# Altium schematic sheet S4V_IMU_Sensor_Module_Board_V1.0_Schematic.SchDoc
size A3; SheetNumber: 1; SheetTotal: 1
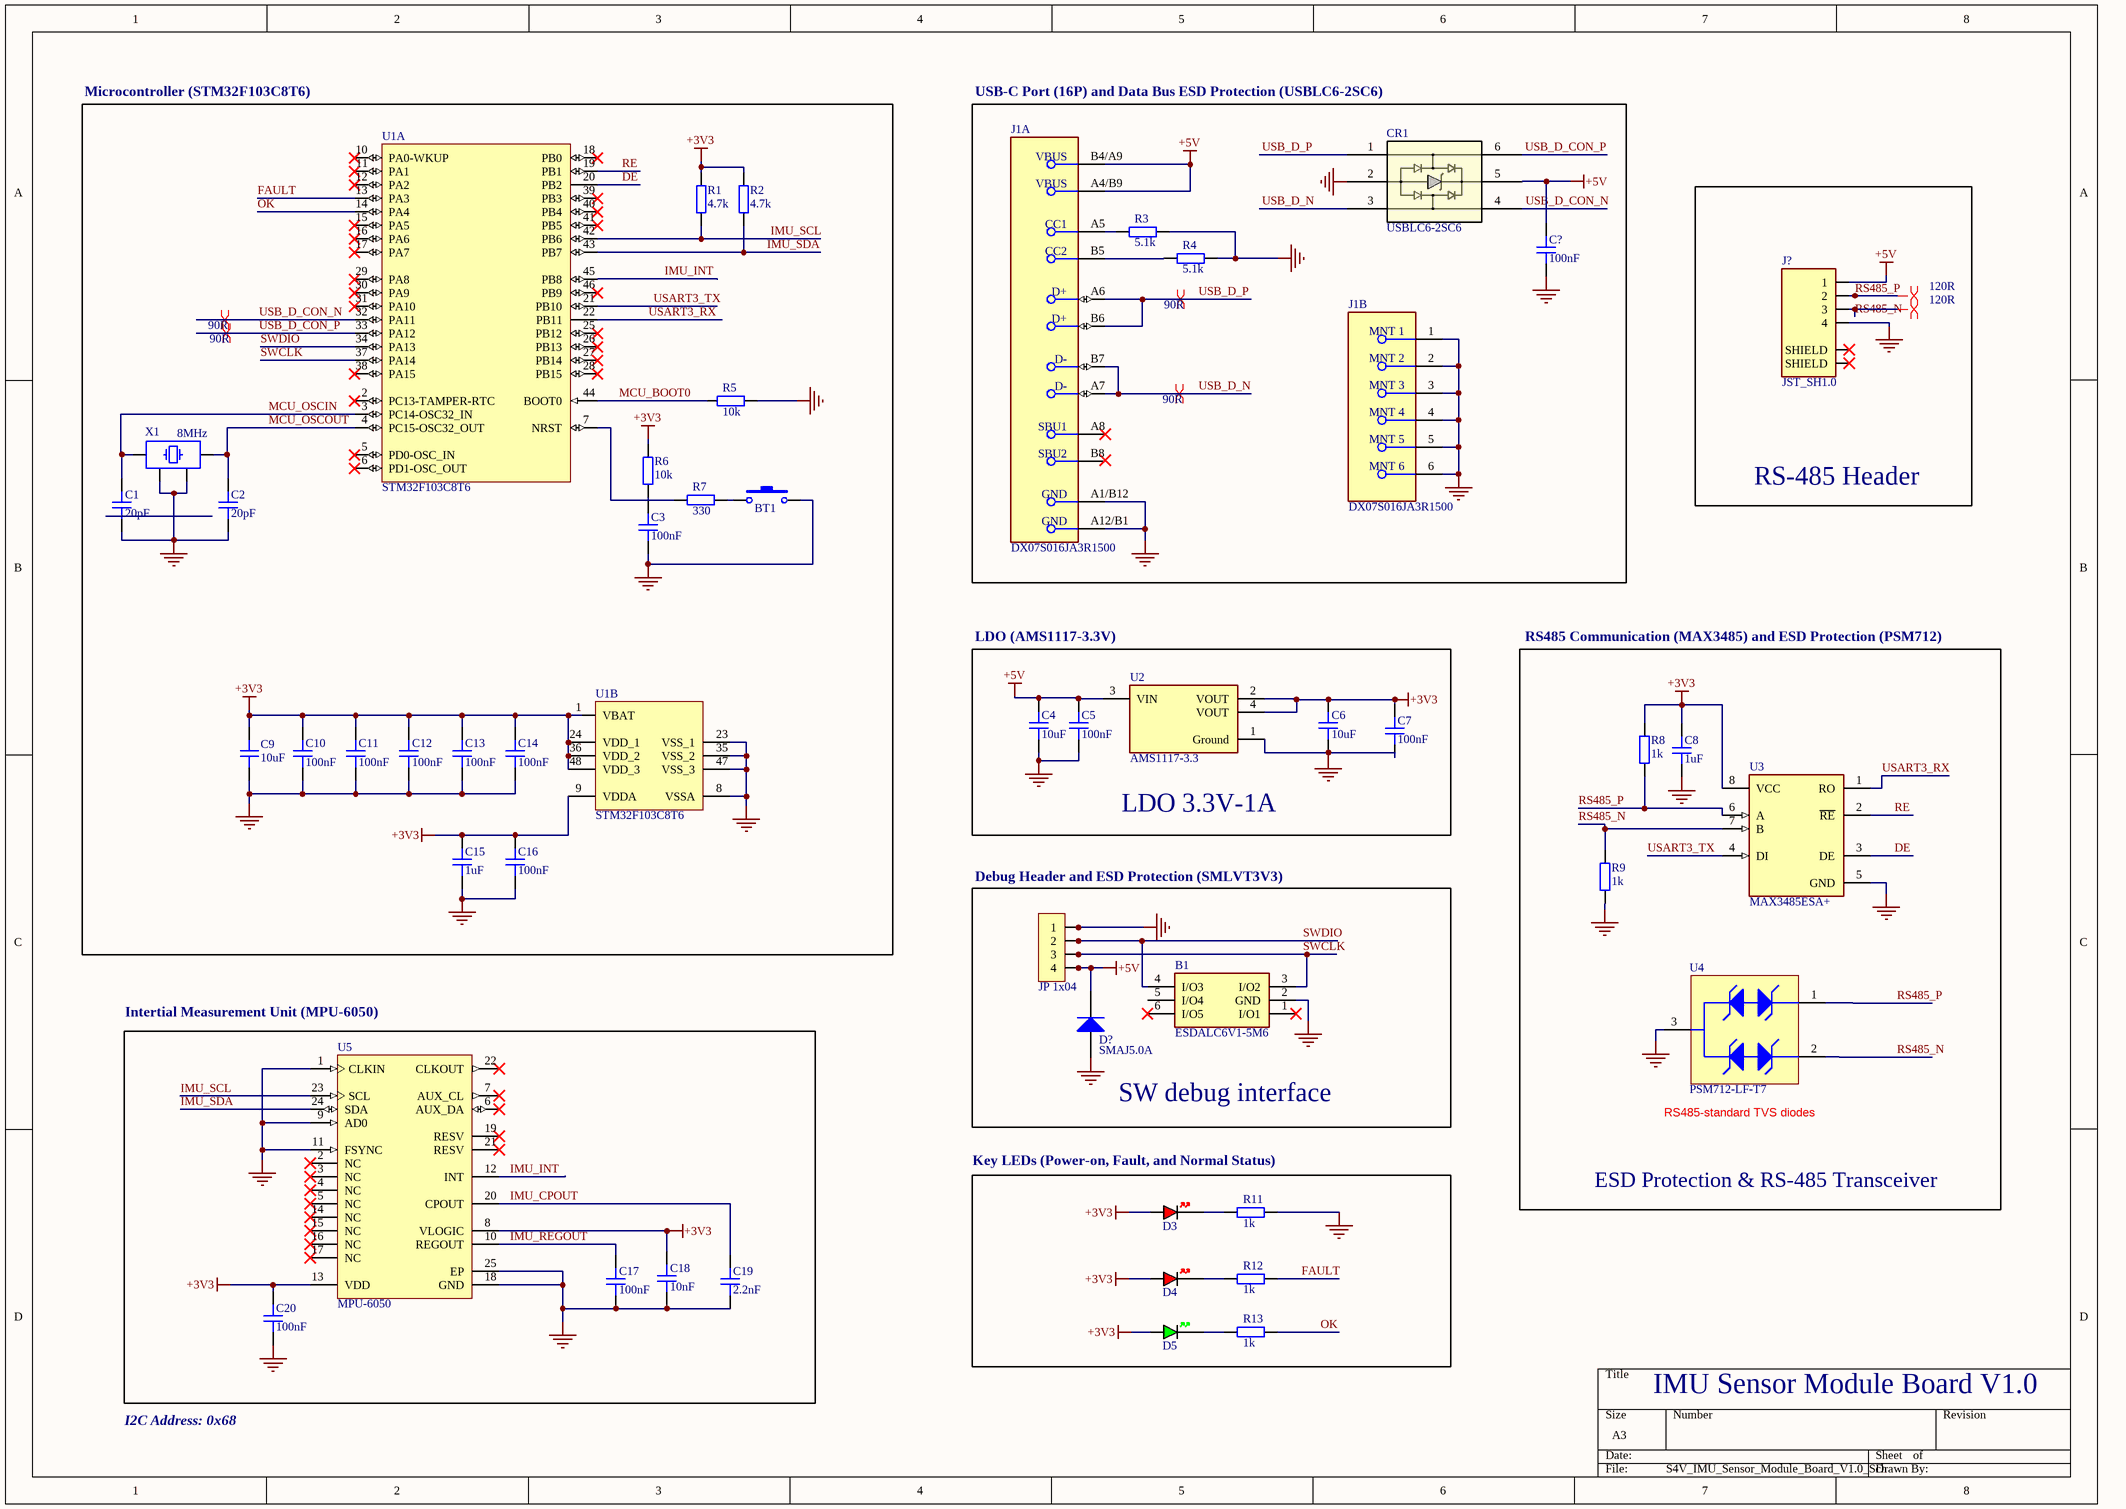
[diagram p0: S4V_IMU_Sensor_Module_Board_V1.0_Schematic.SchDoc]

## Parts
B1  ESDALC6V1-5M6  [ESDALC6V15M6]
BT1  Nut Nhan 2 Chan SMD 3x6x2.5  [Nut Nhan 2 Chan SMD 3x6x2.5]  (value not drawn)
C1  20pF  [CAP_0603]
C2  20pF  [CAP_0603]
C3  100nF  [CAP_0603]
C4  10uF  [CAP_0603]
C5  100nF  [CAP_0603]
C6  10uF  [CAP_0603]
C7  100nF  [CAP_0603]
C8  1uF  [CAP_0603]
C9  10uF  [CAP_0603]
C10  100nF  [CAP_0603]
C11  100nF  [CAP_0603]
C12  100nF  [CAP_0603]
C13  100nF  [CAP_0603]
C14  100nF  [CAP_0603]
C15  1uF  [CAP_0603]
C16  100nF  [CAP_0603]
C17  100nF  [CAP_0603]
C18  10nF  [CAP_0603]
C19  2.2nF  [CAP_0603]
C20  100nF  [CAP_0603]
C?  100nF  [CAP_0603]
CR1  USBLC6-2SC6  [SOT23-6L_STM]
D3  RED  [LED_0603_RED]  (value not drawn)
D4  RED  [LED_0603_RED]  (value not drawn)
D5  GREEN  [LED_0603_GREEN]  (value not drawn)
D?  SMAJ5.0A  [BOUR-SMA-2_V]
J1  DX07S016JA3R1500  [FP-DX07S016JA3R1500-MFG]  (parts A,B of 2)
J?  JST_SH1.0  [JST_SM04B-SRSS-TB(LF)(SN)]
JP1  JP 1x04  [JP 1x4 DT]
R1  4.7k  [RES_0603]
R2  4.7k  [RES_0603]
R3  5.1k  [RES_0603]
R4  5.1k  [RES_0603]
R5  10k  [RES_0603]
R6  10k  [RES_0603]
R7  330  [RES_0603]
R8  1k  [RES_0603]
R9  1k  [RES_0603]
R11  1k  [RES_0603]
R12  1k  [RES_0603]
R13  1k  [RES_0603]
U1  STM32F103C8T6  [STM-LQFP48_L]  (parts A,B of 2)
U2  AMS1117-3.3  [FP-AMS1117-IPC_C]
U3  MAX3485ESA+  [FP-S8-5-MFG]
U4  PSM712-LF-T7  [PRKT-SOT23-3_V]
U5  MPU-6050  [IS-QFN-24_V]
X1  8MHz  [XTAL_3225]

## Blocks framed on the sheet
Microcontroller (STM32F103C8T6): BT1 C1-C3 C9-C16 R1 R2 R5-R7 U1 X1
USB-C Port (16P) and Data Bus ESD Protection (USBLC6-2SC6): C? CR1 J1 R3 R4
RS-485 Header: J?
LDO 3.3V-1A: C4-C7 U2
ESD Protection & RS-485 Transceiver: C8 R8 R9 U3 U4
SW debug interface: B1 D? JP1
Intertial Measurement Unit (MPU-6050): C17-C20 U5
Key LEDs (Power-on, Fault, and Normal Status): D3-D5 R11-R13

## Nets
+3V3: C6.2 C7.2 C8.2 C9.2 C10.2 C11.2 C12.2 C13.2 C14.2 C15.2 C16.2 C18.2 C20.2 D3.A D4.A D5.A R1.2 R2.2 R6.2 R8.1 U1.1(VBAT) U1.9(VDDA) U1.24(VDD_1) U1.36(VDD_2) U1.48(VDD_3) U2.2(VOUT) U2.4(VOUT) U3.8(VCC) U5.8(VLOGIC) U5.13(VDD)
+5V: C4.2 C5.2 C?.2 CR1.5 D?.2(K) J1.A4/B9(VBUS) J1.B4/A9(VBUS) J?.1 JP1.4 U2.3(VIN)
GND: B1.2(GND) BT1.2 C1.1 C2.1 C3.1 C4.1 C5.1 C6.1 C7.1 C8.1 C9.1 C10.1 C11.1 C12.1 C13.1 C14.1 C15.1 C16.1 C17.1 C18.1 C19.1 C20.1 C?.1 CR1.2 D?.1(A) J1.1(MNT_1) J1.2(MNT_2) J1.3(MNT_3) J1.4(MNT_4) J1.5(MNT_5) J1.6(MNT_6) J1.A1/B12(GND) J1.A12/B1(GND) J?.4 JP1.1 R3.2 R4.2 R5.2 R9.1 R11.2 U1.8(VSSA) U1.23(VSS_1) U1.35(VSS_2) U1.47(VSS_3) U2.1(Ground) U3.5(GND) U4.3 U5.1(CLKIN) U5.9(AD0) U5.11(FSYNC) U5.18(GND) U5.25(EP) X1.2 X1.4
DE: U1.20(PB2) U3.3(DE)
FAULT: R12.2 U1.13(PA3)
IMU_CPOUT: C19.2 U5.20(CPOUT)
IMU_INT: U1.45(PB8) U5.12(INT)
IMU_REGOUT: C17.2 U5.10(REGOUT)
IMU_SCL: R1.1 U1.42(PB6) U5.23(SCL)
IMU_SDA: R2.1 U1.43(PB7) U5.24(SDA)
MCU_BOOT0: R5.1 U1.44(BOOT0)
MCU_OSCIN: C1.2 U1.3(PC14-OSC32_IN) X1.1
MCU_OSCOUT: C2.2 U1.4(PC15-OSC32_OUT) X1.3
OK: R13.2 U1.14(PA4)
RE: U1.19(PB1) U3.2(~{RE})
RS485_N: J?.3 R9.2 U3.7(B) U4.2
RS485_P: J?.2 R8.2 U3.6(A) U4.1
SWCLK: B1.3(I/O2) JP1.3 U1.37(PA14)
SWDIO: B1.4(I/O3) JP1.2 U1.34(PA13)
USART3_RX: U1.22(PB11) U3.1(RO)
USART3_TX: U1.21(PB10) U3.4(DI)
USB_D_CON_N: CR1.4 U1.32(PA11)
USB_D_CON_P: CR1.6 U1.33(PA12)
USB_D_N: CR1.3 J1.A7(D-) J1.B7(D-)
USB_D_P: CR1.1 J1.A6(D+) J1.B6(D+)
NetBT1_1: BT1.1 R7.2
NetC3_2: C3.2 R6.1
NetD3_K: D3.K R11.1
NetD4_K: D4.K R12.1
NetD5_K: D5.K R13.1
NetJ1_A5: J1.A5(CC1) R3.1
NetJ1_B5: J1.B5(CC2) R4.1
NetR7_1: R7.1 U1.7(NRST)

Not connected (* = marked no-connect by the designer): B1 1(I/O1)* 5(I/O4) 6(I/O5)*; J1 A8(SBU1)* B8(SBU2); J? S1(SHIELD)* S2(SHIELD)*; U1 2(PC13-TAMPER-RTC)* 5(PD0-OSC_IN)* 6(PD1-OSC_OUT)* 10(PA0-WKUP)* 11(PA1)* 12(PA2)* 15(PA5)* 16(PA6)* 17(PA7)* 18(PB0)* 25(PB12)* 26(PB13)* 27(PB14)* 28(PB15)* 29(PA8)* 30(PA9)* 31(PA10)* 38(PA15)* 39(PB3)* 40(PB4)* 41(PB5)* 46(PB9)*; U5 2(NC)* 3(NC)* 4(NC)* 5(NC)* 6(AUX_DA)* 7(AUX_CL)* 14(NC)* 15(NC)* 16(NC)* 17(NC)* 19(RESV)* 21(RESV)* 22(CLKOUT)*

## Layout directives
differential pair; differential pair class 120R: RS485_N, RS485_P
differential pair; differential pair class 90R: USB_D_CON_N, USB_D_CON_P, USB_D_N, USB_D_P

## Notes on the sheet
- LDO (AMS1117-3.3V)
- RS485 Communication (MAX3485) and ESD Protection (PSM712)
- (near JP1) Debug Header and ESD Protection (SMLVT3V3)
- (near U4) RS485-standard TVS diodes
- IMU Sensor Module Board V1.0
- I2C Address: 0x68

## Library data of the parts
B1 = ESDALC6V1-5M6: STMicroelectronics ESDALC6V1-5M6 Quint Uni-Directional TVS Diode, 30W peak, 6-Pin uQFN; Geometry.Height: 0.65mm; Manufacturer_Name: STMicroelectronics; Manufacturer_Part_Number: ESDALC6V1-5M6; Mouser Part Number: 511-ESDALC6V1-5M6; Mouser Price/Stock: https://www.mouser.co.uk/ProductDetail/STMicroelectronics/ESDALC6V1-5M6?qs=riAxU6JNBCsF7CaldDOuJw%3D%3D; Arrow Part Number: ESDALC6V1-5M6; Arrow Price/Stock: https://www.arrow.com/en/products/esdalc6v1-5m6/stmicroelectronics?utm_currency=USD&region=nac; Datasheet Link: https://www.st.com/resource/en/datasheet/esdalc6v1-5m6.pdf
BT1 = Nut Nhan 2 Chan SMD 3x6x2.5: Ma_Hang: MH001036; Ten: Nút Nhấn 2 Chân 3x6x2.5MM SMD
C1-C20 C? = CAP_0603: Capacitor SMD 0603; Manufacturer: *; Manufacturer Part Number: *; Distributor Link: *; LCSC: *; Rating: *; Dielectric: *
CR1 = USBLC6-2SC6: ESD Protection for USB 2.0 High Speed; Manufacturer_Name: STMicroelectronics; Copyright: Copyright (C) 2025 Ultra Librarian. All rights reserved.; Manufacturer_Part_Number: USBLC6-2SC6; RefDes: RefDes; Type: Type
D3 D4 = LED_0603_RED: LED 0603 RED SMD
D5 = LED_0603_GREEN: LED 0603 GREEN SMD
D? = CMP-2000-07090-1: SMAJ Transient Voltage Suppressor Diode Series, 3.5 V, -55 to 150 degC, 2-Pin SMA, RoHS, Tape and Reel; Manufacturer: Bourns; EDA / CAD Models: DownloadfromAcceleratedDesigns; Unidirectional Channels: 1; Voltage - Breakdown (Min): 6.4V; Voltage - Reverse Standoff (Typ): 5V; Voltage - Clamping (Max) @ Ipp: 9.2V; Other Names: SMAJ5.0ABDKR; Type: Zener; Catalog Drawings: SMAJSeriesFootprintSMAJ,SMBJSeries; Featured Product: SMAJ/SMBJ/SMCJ/SMLJDiscreteTVSDiodes; Power - Peak Pulse: 400W; Current - Peak Pulse (10/1000µs): 43.5A; Power Line Protection: No; Online Catalog: SMAJSeries; Supplier Device Package: SMA(DO-214AC); Operating Temperature: -55°C~150°C(TJ); Package Description: 2-Pin Surface Mount Device, Body 4.315 x 2.605 mm; Datasheet URL: https://datasheet.ciiva.com/25624/0900766b8112213b-25624680.pdf; Manufacturer URL: http://www.bourns.com/; Datasheet Version: 08/2012; Series: SMAJ; Family: TVS-Diodes; Bidirectional Channels: -; Applications: GeneralPurpose; Package Reference: SMA-2; Standard Package: 1; Package / Case: DO-214AC,SMA; Category: CircuitProtection; RoHS Information: SMAJSeriesMaterialDeclaration; Mounting Technology: SurfaceMount; Capacitance @ Frequency: -; Packaging: Digi-Reel®; Mounting Type: SurfaceMount
J1 = CMP-19038-000002-1: CONN RCP USB2.0 TYP C 24P SMD RA
J? = CMP-002-00071-1: Connector Header Surface Mount, Right Angle 4 position 0.039 (1.00mm); MF: JST Sales; Case/Package: None; MP: SM04B-SRSS-TB(LF)(SN); Source: SM04B-SRSS-TB(LF)(SN).SchLib; Value: *; Pins: 6; Component Type: Standard; Check_prices: https://www.snapeda.com/parts/SM04B-SRSS-TB(LF)(SN)/JST/view-part/?ref=eda; SnapEDA_Link: https://www.snapeda.com/parts/SM04B-SRSS-TB(LF)(SN)/JST/view-part/?ref=snap; Design Item ID: SM04B-SRSS-TB(LF)(SN)
JP1 = JP 1x4 2.54 Duc Thang: Cắm; Ten_Linh_Kien: Jump Đơn Đực 2.54MM 1x40P Thẳng 11MM; Don_Vi: Con; Ma_Hang: MH000903; Ghi_Chu: *; Kieu_Chan: *; Chung_Loai: Cắm
R1-R9 R11-R13 = RES_0603: Resistor SMD 0603; Manufacturer: *; Manufacturer Part Number: *; Distributor Link: *; LCSC: *
U1 = CMP-0237-00215-3: ARM Cortex-M3 32-bit MCU, 64 KB Flash, 20 KB Internal RAM, 37 I/Os, 48-pin LQFP, -40 to 85 degC, Tray; Supply Voltage(Vcc) min (V): 2; Internal RAM Size (kB): 20; FLASH Size (Prog) (kB): 64; A/D Converter: 2x12-bit (10 Channel); I/Os (High Current): 37; Operating Frequency(F) (Processor speed) (MHz): 72; Core: ARM Cortex-M3; ComponentLink3Description: Package Specification; Mounting Technology: Surface Mount; PartNumber: STM32F103C8T6; PackageReference: LQFP48; Packing: Tray; ComponentLink3URL: http://www.st.com/st-web-ui/static/active/en/resource/technical/document/datasheet/DM00058181.pdf; DatasheetVersion: Rev. 16; ComponentLink1URL: http://www.st.com/web/en/home.html; PackageVersion: Rev. 6, 06/2013; ComponentLink2URL: http://www.st.com/st-web-ui/static/active/en/resource/technical/document/datasheet/CD00161566.pdf; ComponentLink1Description: Manufacturer URL; ComponentLink2Description: Datasheet; PackageDescription: 48-Pin Low Profile Quad Flat Package, 7 x 7 mm Body, 0.5 mm Pitch
U2 = CMP-209535-000001-1: LDO Voltage Regulators 1A, 3.3V; Manufacturer: Advanced Monolithic Systems; Dropout Voltage: 1.1V; Output Type: Fixed; Nominal Supply Current: 5mA; Max Power Dissipation: 1.2W; Max Supply Voltage: 15V; Number Of Outputs: 1; Standoff Height: 0.64mm; Max Junction Temp: +125°C; Height: 1.8mm; Package: AMS1117; Device Class L2: Power Management ICs; ComponentLink2Description: Datasheet; ComponentLink2URL: http://www.advanced-monolithic.com/pdf/ds1117.pdf; Category: IC; RoHS: TRUE; Automotive: No; Device Class L1: Integrated Circuits (ICs); Output Current: 1A; Device Class L3: Voltage Regulators - Linear; Temperature: -40°C to +125°C; Output Voltage: 3.3V; Manufacturer Part Number: AMS1117-3.3; Temperature Range Low: -40°C; Octopart: https://octopart.com/ams1117-3.3-advanced+monolithic+systems-25899300; Lead Free: Yes; Ipc Land Pattern Name: SOT229P700X180-4; Temperature Range High: +125°C
U3 = CMP-05679-000038-1: IC TXRX RS485/422 10MBPS 8SOIC; Manufacturer Part Number: MAX3485EESA+; Manufacturer: Maxim Integrated; Number Of Receivers: 1; Simplex Duplex: Half Duplex; Data Rate: 15Mbits/s; Interface: RS-485,RS-422; Max Supply Voltage: 3.6V; Nominal Supply Current: 0.95-1.1mA; Min Supply Voltage: 3V; Standoff Height: 0.1mm; Mouser Description: RS-422/RS-485 Interface IC 3.3V 12Mbps Transceiver; Lead Free: Yes; Footprint Url: https://pdfserv.maximintegrated.com/land_patterns/90-0096.PDF; Device Class L1: Integrated Circuits (ICs); Device Class L3: RS-232 / RS-422 / RS-485 Interface ICs; RoHS: TRUE; Height: 1.75mm; ComponentLink2URL: https://datasheets.maximintegrated.com/en/ds/MAX3483E-MAX3491E.pdf; Temperature Range High: +85°C; Temperature: -40°C to +85°C; Number Of Transmitters: 1; Device Class L2: Interface ICs; Octopart: https://octopart.com/max3485eesa%2B-maxim+integrated-39731903; ComponentLink2Description: Datasheet; Category: IC; Digikey Description: IC TXRX RS485/422 10MBPS 8SOIC; Automotive: No; Temperature Range Low: -40°C; Package: S8-5
U4 = CMP-2000-07553-1: TVS Array - Asymmetrical Data Line Protector, 600 W, 7.5 V, -55 to 150 degC, 3-Pin SOT23, RoHS, Tape and Reel; Manufacturer: Protek Devices; Min Breakdown Voltage: 7.5V; Direction: Bidirectional; Capacitance: 75pF; Current: 20uA; Power Dissipation: 600W; Working Voltage: 7V; Voltage: 12V; Case\/Package: SOT-23; Clamping Voltage: 17V; Element Configuration: Dual; Mounting Technology: SurfaceMount; RoHSCompliant: True; Radiation Hardening: No; Depth: 1.4mm; Lead Free: LeadFree; Package Description: 3-Pin Small Outline Transistor, Body 2.92 x 1.3 mm, Pitch 0.94 mm; Max Operating Temperature: 150degC; Length: 3.04mm; Manufacturer URL: http://www.protekdevices.com/; Min Operating Temperature: -55degC; Leakage Current: 20uA; Datasheet URL: www.protekdevices.com/xyz/documents/datasheets/psm712.pdf; Packaging: TapeandReel; Datasheet Version: 10/2013; Package Reference: SOT23-3; Number of Pins: 3
U5 = CMP-1753-00002-2: 3-Axis Gyroscope, Accelerometer and a Digital Motion Processor(TM) (DMP), 2.375 to 3.46 V, -40 to 85 degC, 24-Pin QFN, RoHS, Tape and Reel; Manufacturer: InvenSense; Featured Product: MPU-60506-Axis,IntegratedI²CSolution; Other Names: 1428-1007-2 / MPU6050; Sensor Type: MotionTracking; Online Catalog: MPU-6000™Series; Unit PriceUSD: Digital; Datasheet Version: Rev. 3.3, 05/2012; Category: Sensors,Transducers; Datasheet URL: http://datasheet.octopart.com/MPU-6050-InvenSense-datasheet-14421344.pdf; Family: Multifunction; Standard Package: 5,000; Manufacturer URL: http://www.invensense.com/; Output Type: Digital; Dynamic Catalog: MPU-6000™Series
X1 = TSX-3225_24.0000MF15X-AC: Crystal SMD 24MHz 10PPM 7pF 3225; Manufacturer: Epson; Manufacturer Part Number: TSX-3225 24.0000MF15X-AC